# EAGLE design Trem-O-Drive (EAGLE 7.6.0)
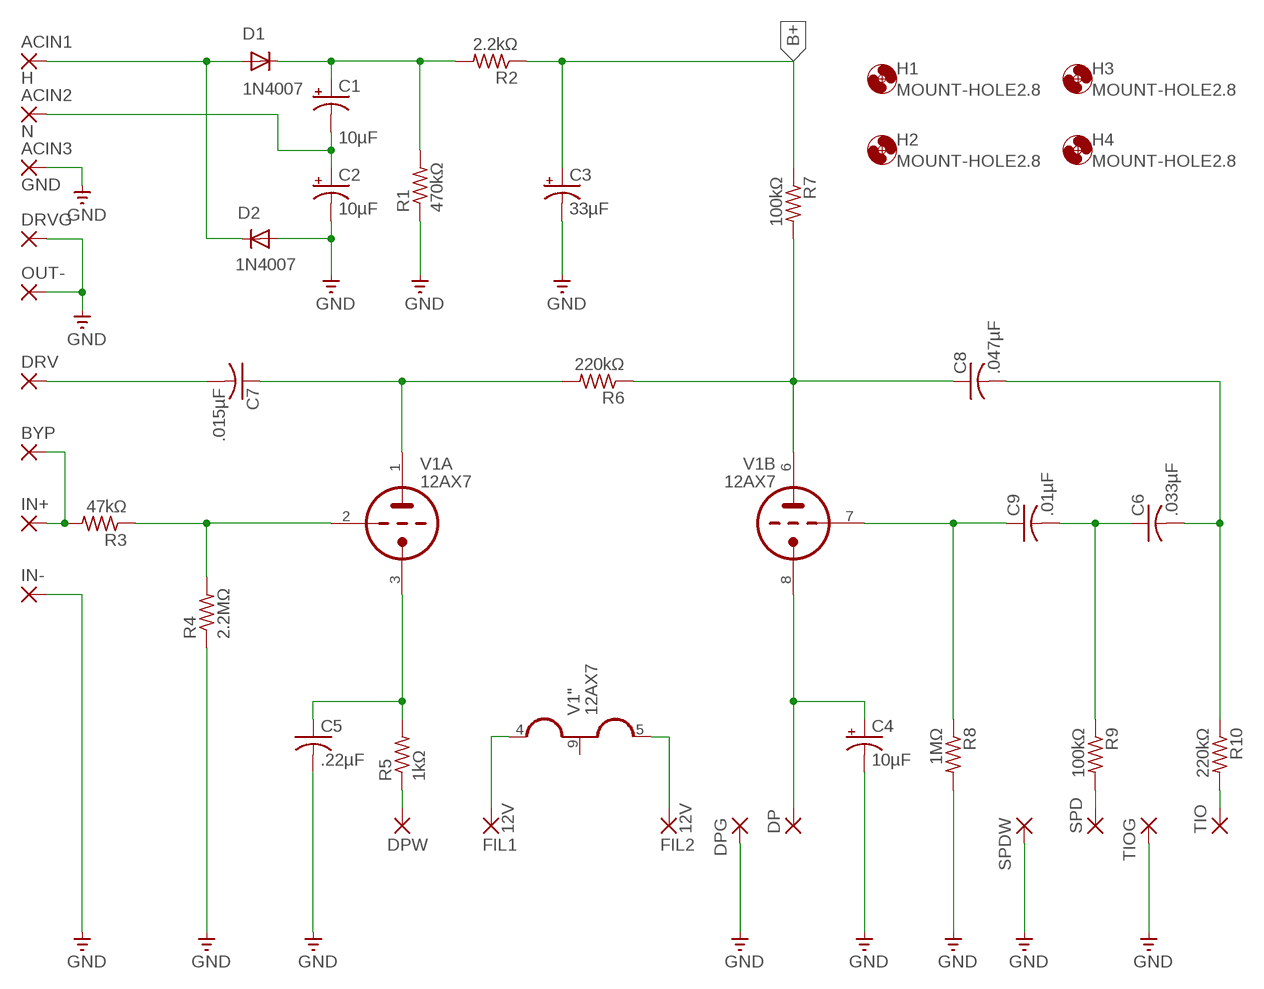
[diagram p0: schematic, sheet 1]

## Parts
ACIN1  H  3,81/1,4  [3,81/1,4]
ACIN2  N  3,81/1,4  [3,81/1,4]
ACIN3  GND  3,81/1,4  [3,81/1,4]
BYP  3,81/1,4  [3,81/1,4]
C1  10µF  CPOL-USE5-10.5  [E5-10,5]
C2  10µF  CPOL-USE5-10.5  [E5-10,5]
C3  33µF  CPOL-USE5-10.5  [E5-10,5]
C4  10µF  CPOL-USE5-10.5  [E5-10,5]
C5  .22µF  C-US150-064X183  [C150-064X183]
C6  .033µF  C-US102-064X133  [C102-064X133]
C7  .015µF  C-US102-064X133  [C102-064X133]
C8  .047µF  C-US102-064X133  [C102-064X133]
C9  .01µF  C-US102-064X133  [C102-064X133]
D1  1N4007  DIODE1N4148  [DIODE-1N4148]
D2  1N4007  DIODE1N4148  [DIODE-1N4148]
DP  3,81/1,4  [3,81/1,4]
DPG  3,81/1,4  [3,81/1,4]
DPW  3,81/1,4  [3,81/1,4]
DRV  3,81/1,4  [3,81/1,4]
DRVG  3,81/1,4  [3,81/1,4]
FIL1  12V  3,81/1,4  [3,81/1,4]
FIL2  12V  3,81/1,4  [3,81/1,4]
H1  MOUNT-HOLE2.8  [2,8]
H2  MOUNT-HOLE2.8  [2,8]
H3  MOUNT-HOLE2.8  [2,8]
H4  MOUNT-HOLE2.8  [2,8]
IN+  3,81/1,4  [3,81/1,4]
IN-  3,81/1,4  [3,81/1,4]
OUT-  3,81/1,4  [3,81/1,4]
R1  470kΩ  R-US_0411/12  [0411/12]
R2  2.2kΩ  R-US_0411/12  [0411/12]
R3  47kΩ  R-US_0411/12  [0411/12]
R4  2.2MΩ  R-US_0411/12  [0411/12]
R5  1kΩ  R-US_0411/12  [0411/12]
R6  220kΩ  R-US_0411/12  [0411/12]
R7  100kΩ  R-US_0411/12  [0411/12]
R8  1MΩ  R-US_0411/12  [0411/12]
R9  100kΩ  R-US_0411/12  [0411/12]
R10  220kΩ  R-US_0411/12  [0411/12]
SPD  3,81/1,4  [3,81/1,4]
SPDW  3,81/1,4  [3,81/1,4]
TIO  3,81/1,4  [3,81/1,4]
TIOG  3,81/1,4  [3,81/1,4]
V1  12AX7  12AX7-P  [NOVAL]

## Nets
B+: C3.+ R2.1 R7.1
FIL1: FIL1.1(P) V1.4(":H1)
FIL2: FIL2.1(P) V1.5(":H3)
GND: ACIN3.1(P) C2.- C3.- C4.- C5.2 D2.A DPG.1(P) DRVG.1(P) IN-.1(P) OUT-.1(P) R1.1 R4.1 R8.2 SPDW.1(P) TIOG.1(P)
N$1: ACIN1.1(P) D1.A D2.C
N$2: C1.+ D1.C R1.2 R2.2
N$3: ACIN2.1(P) C1.- C2.+
N$4: C4.+ DP.1(P) V1.8(B:TK)
N$5: DPW.1(P) R5.1
N$6: C9.1 R8.1 V1.7(B:TG)
N$7: C6.1 C9.2 R9.1
N$10: C6.2 C8.2 R10.1
N$11: R9.2 SPD.1(P)
N$12: R3.1 R4.2 V1.2(A:TG)
N$13: C7.2 DRV.1(P)
N$15: C7.1 R6.2 V1.1(A:TA)
N$16: C8.1 R6.1 R7.2 V1.6(B:TA)
N$17: R10.2 TIO.1(P)
N$18: BYP.1(P) IN+.1(P) R3.2
N$20: C5.1 R5.2 V1.3(A:TK)
Unconnected: V1.9(":H2)

## Library data of the parts
ACIN1-ACIN3 BYP DP DPG DPW DRV DRVG FIL1 FIL2 IN+ IN- OUT- SPD SPDW TIO TIOG = wirepad:3,81/1,4: THROUGH-HOLE PAD
C1-C4 = rcl:CPOL-US: POLARIZED CAPACITOR, American symbol
C5-C9 = rcl:C-US: CAPACITOR, American symbol
D1 D2 = SparkFun-DiscreteSemi:DIODE: Diode These are standard reverse protection diodes and small signal diodes. SMA package can handle up to about 1A. SOD-323 can handle about 200mA. What the SOD-323 package when ordering, there are some mfgs out there that are 5-pin packages.
H1-H4 = holes:MOUNT-HOLE: MOUNTING HOLE with drill center marker
R1-R10 = rcl:R-US_: RESISTOR, American symbol
V1 = tubes:12AX7-P

## Board
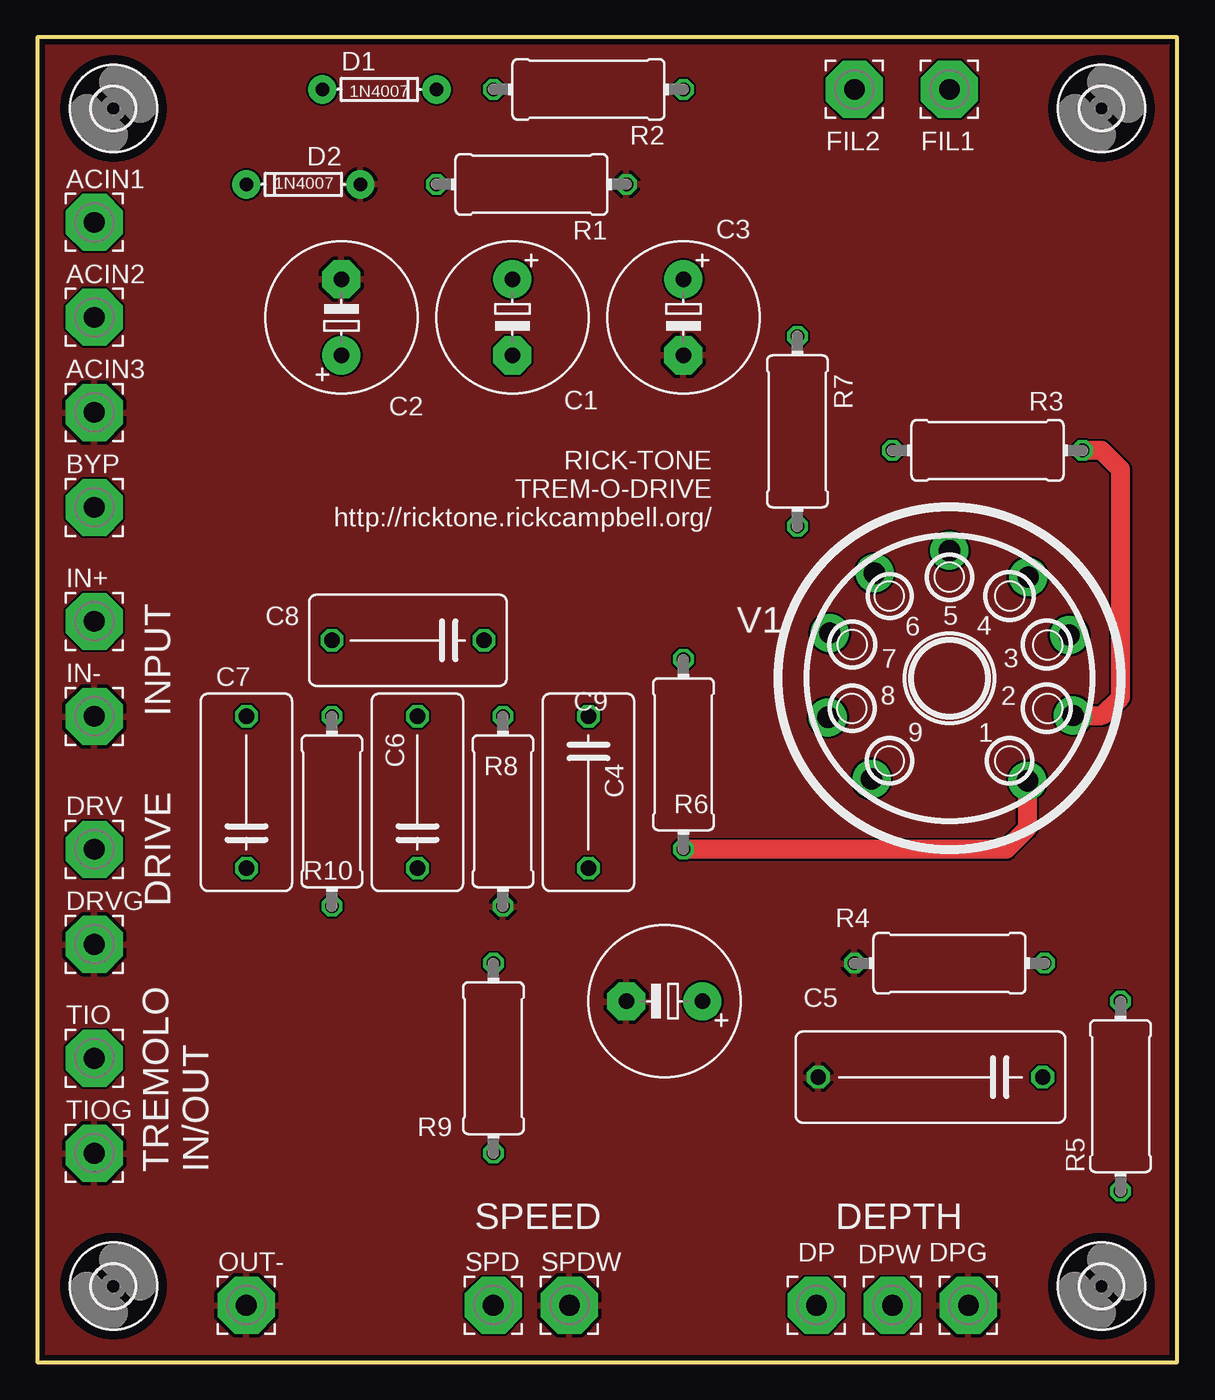
[diagram p1: board, top side]
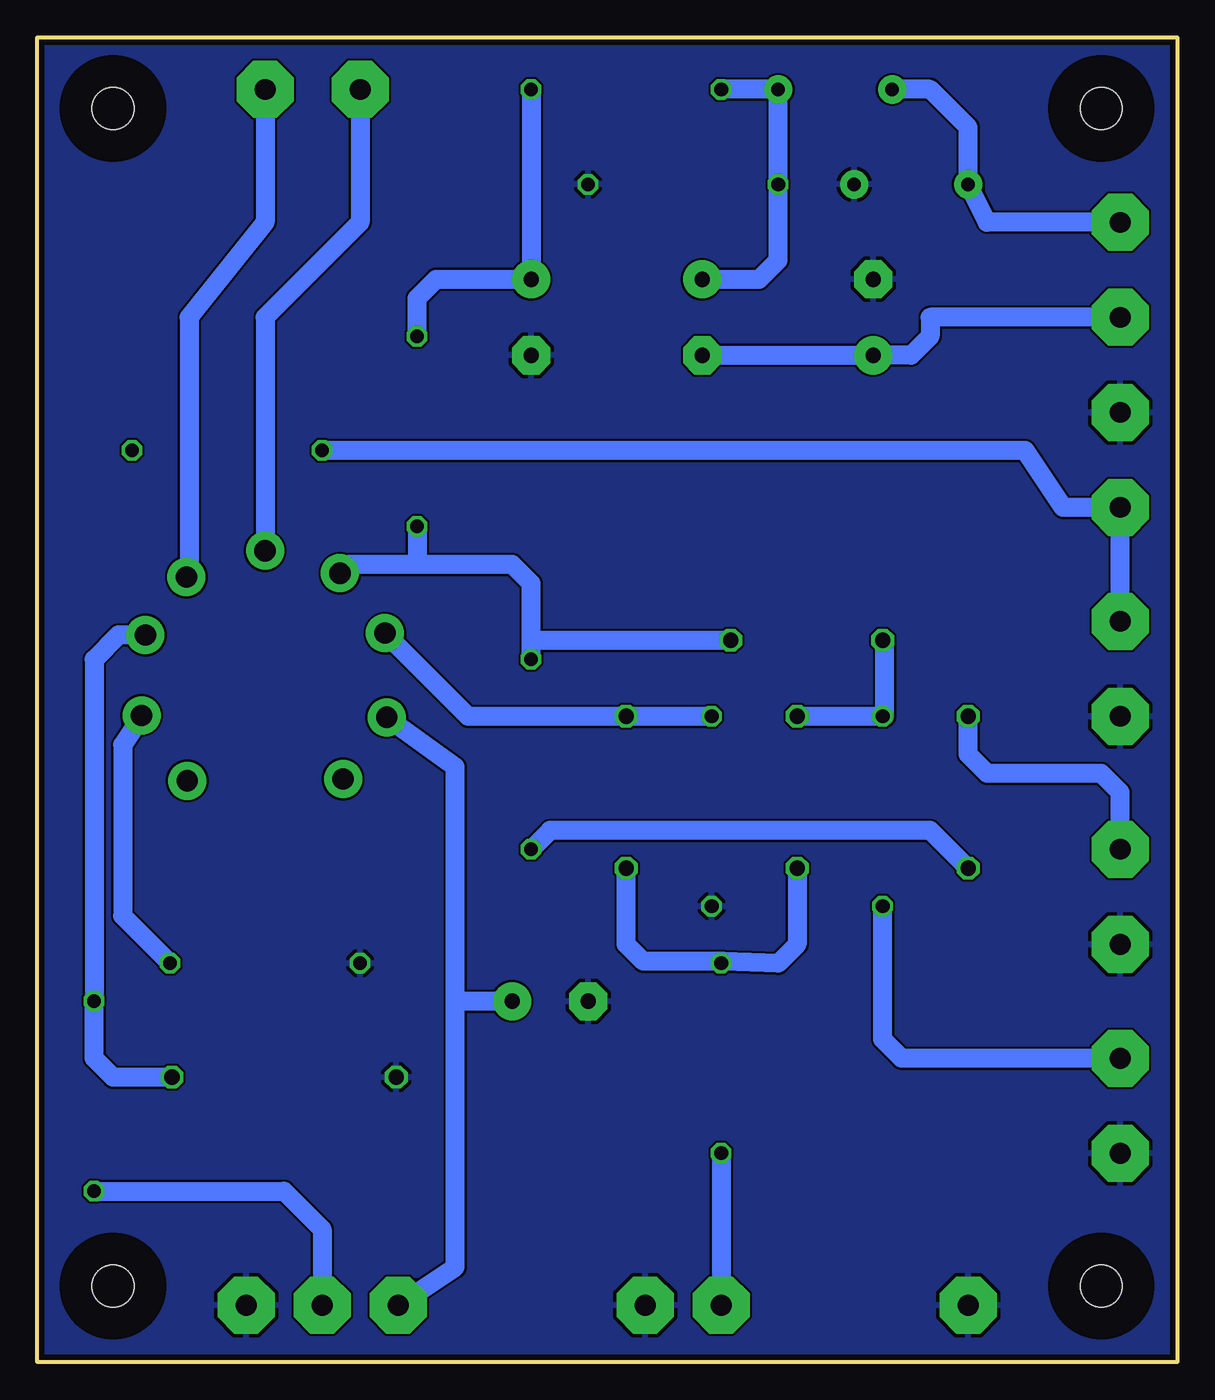
[diagram p2: board, bottom side, seen from below]

Size 76.18 x 88.57 mm. Coordinates in mm from the lower left corner, seen from the top.
Outline: 0,0 76.18,0 76.18,88.57 0,88.57 0,0
Copper layers (1*16): Top 0.0356mm / dielectric 1.5011mm / Bottom 0.0356mm
Design rules "LaenPCBOrder": minimum track width 6mil, minimum drill 13mil, track to track 6mil, track to pad 6mil, pad to pad 6mil, via to via 6mil, smd to smd 6mil, copper to edge 15mil, drill to drill 6mil, minimum pad ring 7mil, minimum via ring 7mil, stop-mask expansion 3mil, vias tented up to drill 0mil, thermal gap 10mil

### Footprints (pad centres in the part's own frame; a part is rotated, then mirrored left to right if it is on the bottom)
3,81/1,4 = drill 1.397 pad 3.81 octagon: 1 0,0
E5-10,5 = drill 1.016 pad 2.54: + -2.54,0 | drill 1.016 pad 2.54 octagon: - 2.54,0
C150-064X183 = drill 1.016 octagon: 1 -7.493,0; 2 7.493,0
C102-064X133 = drill 1.016 octagon: 1 -5.08,0; 2 5.08,0
DIODE-1N4148 = drill 0.9 pad 1.88: A -3.81,0; C 3.81,0
2,8 = hole 2.8: 0,0
0411/12 = drill 0.914 octagon: 1 -6.35,0; 2 6.35,0
NOVAL = drill 1.422 pad 2.54: 1 5.207,-6.858; 2 8.254,-2.484; 3 8.004,2.893; 4 5.258,6.77; 5 0,8.524; 6 -5.004,7.024; 7 -8.004,3.02; 8 -8.127,-2.611; 9 -5.207,-6.731

### Placement (x,y rotation side)
ACIN1  3.81,76.2 0 top
ACIN2  3.81,69.85 0 top
ACIN3  3.81,63.5 0 top
BYP  3.81,57.15 0 top
C1  31.75,69.85 270 top
C2  20.32,69.85 90 top
C3  43.18,69.85 270 top
C4  41.91,24.13 180 top
C5  59.69,19.05 180 top
C6  25.4,38.1 90 top
C7  13.97,38.1 90 top
C8  24.77,48.26 180 top
C9  36.83,38.1 270 top
D1  22.86,85.09 0 top
D2  17.78,78.74 180 top
DP  52.07,3.81 0 top
DPG  62.23,3.81 0 top
DPW  57.15,3.81 0 top
DRV  3.81,34.29 0 top
DRVG  3.81,27.94 0 top
FIL1  60.96,85.09 0 top
FIL2  54.61,85.09 0 top
H1  5.08,5.08 0 top
H2  5.08,83.82 0 top
H3  71.12,5.08 0 top
H4  71.12,83.82 0 top
IN+  3.81,49.53 0 top
IN-  3.81,43.18 0 top
OUT-  13.97,3.81 0 top
R1  33.02,78.74 180 top
R2  36.83,85.09 180 top
R3  63.5,60.96 180 top
R4  60.96,26.67 0 top
R5  72.39,17.78 90 top
R6  43.18,40.64 270 top
R7  50.8,62.23 270 top
R8  31.11,36.83 270 top
R9  30.48,20.32 270 top
R10  19.68,36.83 270 top
SPD  30.48,3.81 0 top
SPDW  35.56,3.81 0 top
TIO  3.81,20.32 0 top
TIOG  3.81,13.97 0 top
V1  60.96,45.72 0 top

### Tracks (layer width: path | path; a pad name or v marks a point on that pad's centre or on a via)
B+
  Bottom 1.27: R2.1 C3.+ 49.53,72.39 50.8,71.12 R7.1
FIL1
  Bottom 1.27: FIL1.1 60.96,76.2 66.04,69.85 66.04,52.67 V1.4
FIL2
  Bottom 1.27: FIL2.1 54.61,76.2 60.96,69.85 V1.5
GND
  pour Bottom: 0,0 0,88.9 76.2,88.9 76.2,0
  pour Top: 0,88.9 76.2,88.9 76.2,0 0,0
N$1
  Bottom 1.27: ACIN1.1 12.7,76.2 D2.C 13.97,82.55 16.51,85.09 D1.A
N$2
  Bottom 1.27: R2.2 D1.C R1.2 26.67,73.66 27.94,72.39 C1.+
N$3
  Bottom 1.27: C1.- C2.+ 17.78,67.31 16.51,68.58 16.51,69.85 ACIN2.1
N$4
  Bottom 1.27: DP.1 48.26,6.35 48.26,24.13 | 48.26,24.13 48.26,39.81 V1.8 | C4.+ 48.26,24.13
N$5
  Bottom 1.27: R5.1 59.69,11.43 57.15,8.89 DPW.1
N$6
  Bottom 1.27: V1.7 47.4,43.18 C9.1 R8.1
N$7
  Bottom 1.27: C6.1 25.4,27.94 26.67,26.67 30.35,26.8 | 30.35,26.8 R9.1 | 30.35,26.8 35.69,26.8 36.83,27.94 C9.2
N$10
  Bottom 1.27: C6.2 R10.1 19.56,43.18 19.56,48.13 C8.2
N$11
  Bottom 1.27: R9.2 SPD.1
N$12
  Top 1.27: V1.2 71.18,43.24 72.39,44.45 72.39,59.69 71.12,60.96 R3.1
  Bottom 1.27: V1.2 69.21,43.18 70.48,41.27 70.48,29.84 R4.2
N$13
  Bottom 1.27: DRV.1 3.81,38.1 5.08,39.37 12.7,39.37 13.97,40.64 C7.2
N$15
  Top 1.27: V1.1 66.17,35.69 64.77,34.29 R6.2
  Bottom 1.27: C7.1 16.51,35.56 41.91,35.56 R6.2
N$16
  Bottom 1.27: 50.8,53.34 55.36,53.34 V1.6 | R7.2 50.8,53.34 | R6.1 43.18,48.26 | C8.1 43.18,48.26 | 43.18,48.26 43.18,52.07 44.45,53.34 50.8,53.34
N$17
  Bottom 1.27: TIO.1 18.41,20.32 19.68,21.59 R10.2
N$18
  Bottom 1.27: IN+.1 BYP.1 7.62,57.15 10.16,60.96 R3.2
N$20
  Bottom 1.27: V1.3 70.77,48.61 72.39,46.99 R5.2 72.39,20.32 71.12,19.05 C5.1

### Text on the board
tNames: RICK-TONE / TREM-O-DRIVE / http://ricktone.rickcampbell.org/ | INPUT | DRIVE | TREMOLO / IN/OUT | SPEED | DEPTH